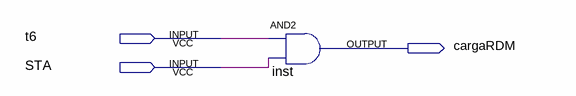
[diagram p0: schematic sheet]
// Quartus schematic cargaRDM.bdf as structural Verilog: 1 symbols, 3 pins
module cargaRDM (
  input  t6,
  input  STA,
  output cargaRDM
);

  and inst (cargaRDM, t6, STA);
endmodule
